# Altium schematic sheet 06_STM43F4_UART.SchDoc
size A4; SheetNumber: 7; SheetTotal: 7
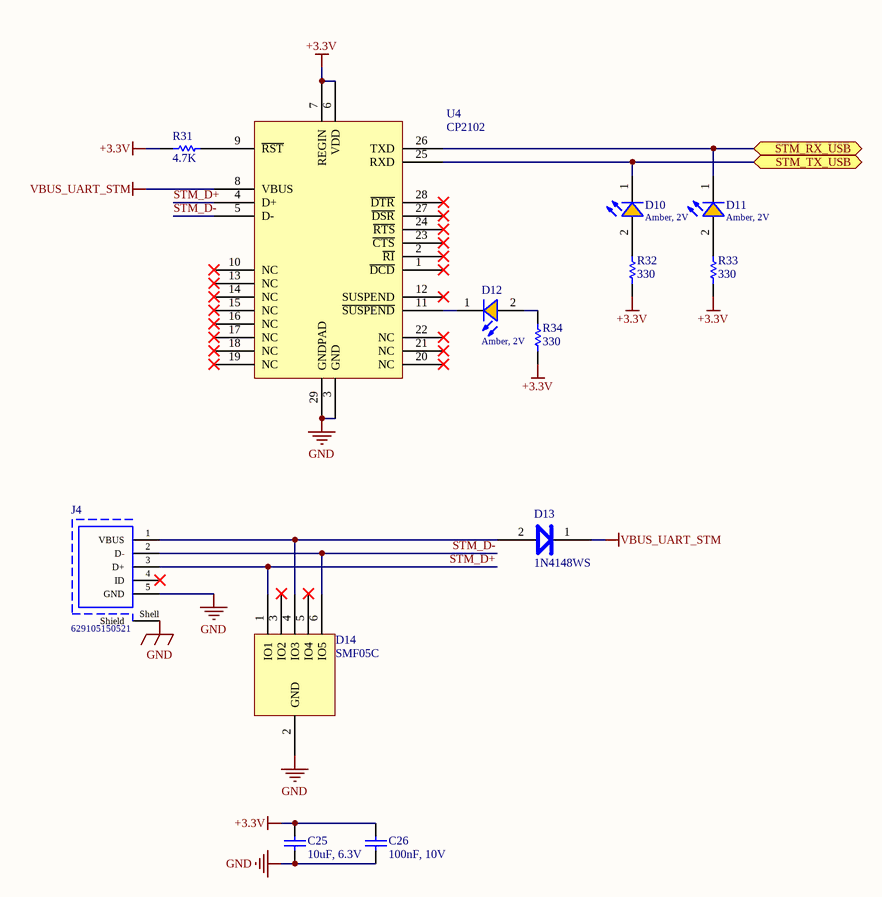
[diagram p0: 06_STM43F4_UART.SchDoc]

## Parts
C25  10uF, 6.3V  [WCAP-CSGP_0603_H=0.8mm_Reflow]
C26  100nF, 10V  [WCAP-CSGP_0603_H=0.8mm_Reflow]
D10  Amber, 2V  [WL-SMCW_0603_H=0.7mm]
D11  Amber, 2V  [WL-SMCW_0603_H=0.7mm]
D12  Amber, 2V  [WL-SMCW_0603_H=0.7mm]
D13  1N4148WS  [SODFL250X90-2N]
D14  SMF05C  [SOT65P210X110-6N]
J4  629105150521  [629105150521]
R31  value 4.7K  [RES-SM-0603]  (hidden comment: RESISTOR SMD)
R32  value 330  [RES-SM-0603]  (hidden comment: RESISTOR SMD)
R33  value 330  [RES-SM-0603]  (hidden comment: RESISTOR SMD)
R34  value 330  [RES-SM-0603]  (hidden comment: RESISTOR SMD)
U4  CP2102  [QFN50P500X500X90_HS-29N]

## Ports
STM_RX_USB (bidir), STM_TX_USB (bidir)

## Nets
+3.3V: C25.2 C26.2 R31.2 R32.2 R33.2 R34.2 U4.6(VDD) U4.7(REGIN)
GND: C25.1 C26.1 D14.2(GND) J4.5(GND) J4.Shell(Shield) U4.3(GND) U4.29(GNDPAD)
VBUS_UART_STM: D13.1 U4.8(VBUS)
STM_D+: D14.1(IO1) J4.3(D+) U4.4(D+)
STM_D-: D14.6(IO5) J4.2(D-) U4.5(D-)
STM_RX_USB: D11.1(K) U4.26(TXD) ; port STM_RX_USB
STM_TX_USB: D10.1(K) U4.25(RXD) ; port STM_TX_USB
NetD10_2: D10.2(A) R32.1
NetD11_2: D11.2(A) R33.1
NetD12_1: D12.1(K) U4.11(~{SUSPEND})
NetD12_2: D12.2(A) R34.1
NetD13_2: D13.2 D14.4(IO3) J4.1(VBUS)
NetR31_1: R31.1 U4.9(~{RST})

Not connected (* = marked no-connect by the designer): D14 3(IO2)* 5(IO4)*; J4 4(ID)*; U4 1(~{DCD})* 2(~{RI})* 10(NC)* 12(SUSPEND)* 13(NC)* 14(NC)* 15(NC)* 16(NC)* 17(NC)* 18(NC)* 19(NC)* 20(NC)* 21(NC)* 22(NC)* 23(~{CTS})* 24(~{RTS})* 27(~{DSR})* 28(~{DTR})*

## Library data of the parts
C25 = 885012106006: WCAP-CSGP Multilayer Ceramic Chip Capacitor, General Purpose, size 0603, X5R, 10uF, 6.3V; Manufacturer: Wurth Elektronik; Rated Voltage: 6.3VDC; Isolation Resistance: >=0.01GOhm; Capacitance Tolerance: +/-20%; Technical Reference: X5R0603106M6R3DFCT10000; ComponentLink1Description: Manufacturer; ComponentLink1URL: http://www.we-online.de; ComponentLink2Description: Datasheet; ComponentLink2URL: https://www.we-online.com/catalog/datasheet/885012106006.pdf; Operating Temperature: -55 to +85degC; Packaging: Tape and Reel; Manufacturer Part Number: 885012106006; Published Date: May 2020; Ceramic Type: X5R; Dissipation Factor: =<10%; Height: 0.8mm; Mounting Technology: SMT; Size: 0603; Capacitance: 10uF
C26 = 885012206020: WCAP-CSGP Multilayer Ceramic Chip Capacitor, General Purpose, size 0603, X7R, 100nF, 10V; Manufacturer: Wurth Elektronik; Rated Voltage: 10VDC; Isolation Resistance: >=5GOhm; Capacitance Tolerance: +/-10%; Technical Reference: X7R0603104K010DFCT10000; ComponentLink1Description: Manufacturer; ComponentLink1URL: http://www.we-online.de; ComponentLink2Description: Datasheet; ComponentLink2URL: https://www.we-online.com/catalog/datasheet/885012206020.pdf; Operating Temperature: -55 to +125degC; Packaging: Tape and Reel; Manufacturer Part Number: 885012206020; Published Date: May 2020; Ceramic Type: X7R; Dissipation Factor: =<5%; Height: 0.8mm; Mounting Technology: SMT; Size: 0603; Capacitance: 100nF
D10-D12 = 150060AS75000: WL-SMCW SMT Mono-color Chip LED Waterclear, size 0603, Amber, 2V, 140deg; Chip Technology: AlInGaP; Dominant Wavelength typ.: 605nm; Luminous Intensity typ.: 130mcd; Peak Wavelength typ.: 610nm; Viewing Angle: 140deg; ComponentLink1Description: Manufacturer; ComponentLink1URL: http://www.we-online.de; ComponentLink2URL: https://www.we-online.com/catalog/datasheet/150060AS75000.pdf; ComponentLink2Description: Datasheet; Forward Voltage typ.: 2V; Emitting Color: Amber; Mounting Technology: SMT; Operating Temperature: -40 to +85degC; Published Date: December 2019; Part Number: 150060AS75000; Packaging: Tape and Reel; Size: 0603; Publisher: Wurth Elektronik
J4 = 629105150521: Micro USB 2.0 Type B Receptacle WR-COM, Horizontal, SMT, with Pegs, High Current at Pin 1 & Pin 5; Rated Current: 3 A; Contact Resistance: 30 mOhm; Working Voltage: 30 VAC; ComponentLink1Description: Manufacturer; ComponentLink1URL: http://www.we-online.de; ComponentLink2Description: Datasheet; ComponentLink2URL: https://katalog.we-online.de/em/datasheet/629105150521.pdf; Part Number: 629105150521; Published Date: September 2018; Publisher: Wurth Elektronik; Orientation: Horizontal; Connector Type: Micro USB 2.0 Type B; Operating Temperature: -40 to 85 degC; Mounting Technology: SMT; Gender: Receptacle; Packaging: Tape and Reel
R31-R34 = RESISTOR SMD: Resistor